# EAGLE design RF_module (EAGLE 7.2.0)
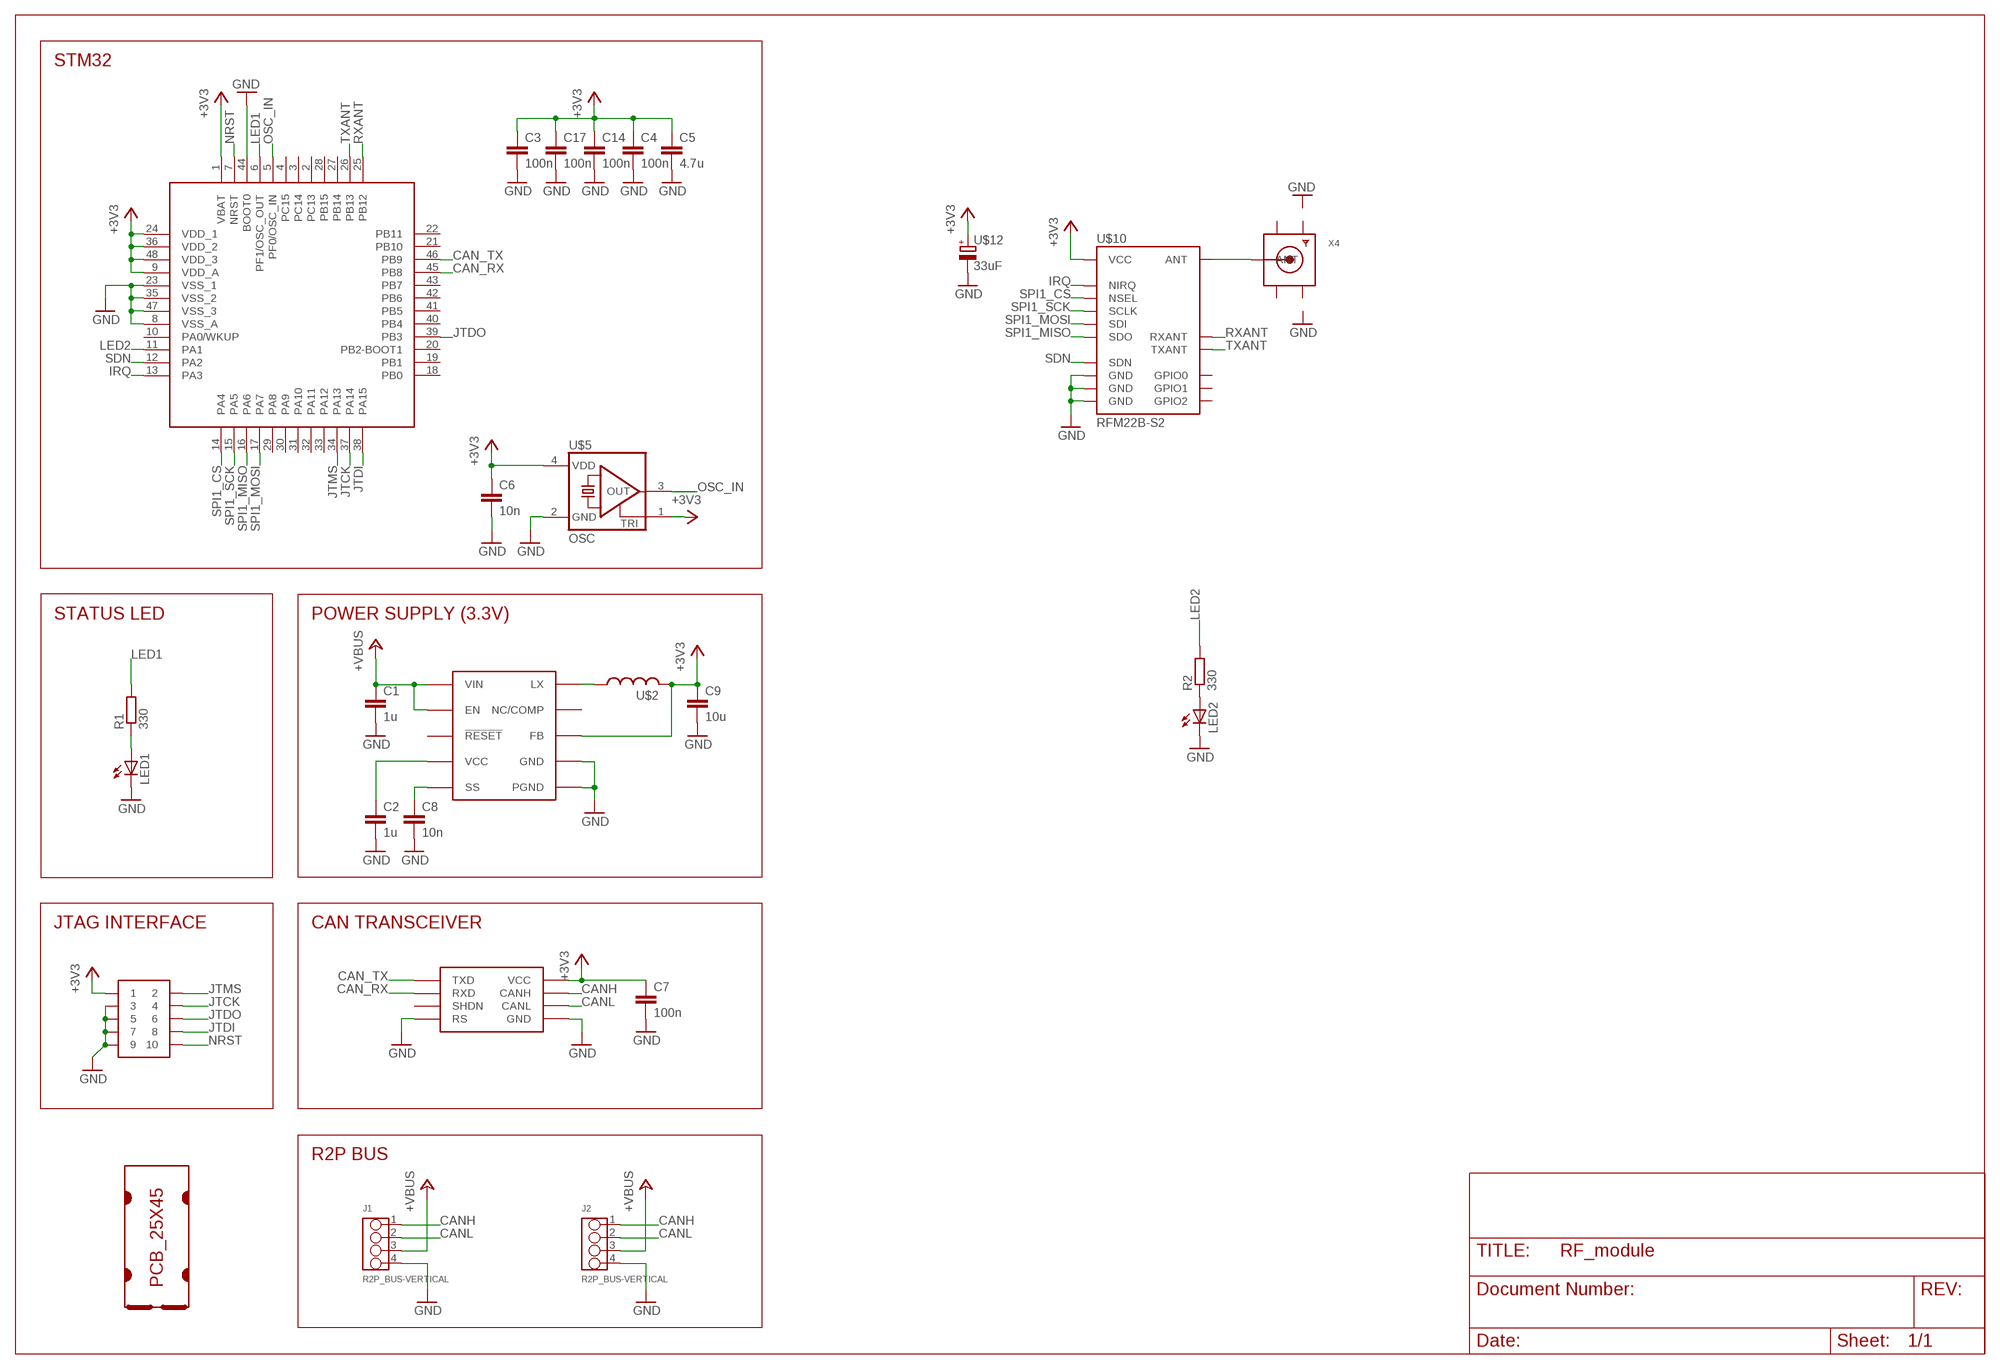
[diagram p0: schematic, sheet 1]

## Parts
C1  1u  C1206  [C1206]
C2  1u  C0603  [C0603]
C3  100n  C0603  [C0603]
C4  100n  C0603  [C0603]
C5  4.7u  C0805  [C0805]
C6  10n  C0603  [C0603]
C7  100n  C0603  [C0603]
C8  10n  C0603  [C0603]
C9  10u  C0805  [C0805]
C14  100n  C0603  [C0603]
C17  100n  C0603  [C0603]
J1  R2P_BUS-VERTICAL  [OPL-EAGLE-LIBRARY_4P-2.0]
J2  R2P_BUS-VERTICAL  [OPL-EAGLE-LIBRARY_4P-2.0]
LED1  LED0805  [CHIPLED_0805]
LED2  LED0805  [CHIPLED_0805]
R1  330  R0603  [R0603]
R2  330  R0603  [R0603]
SOT1  MAX3051EKA  [SOT23-8L]
U$1  PCB_25X45  [25X45]
U$2  LPS4018  [COILCRAFT_LPS4018]
U$3  MAX17501  [TDFN-10]
U$4  JTAG-TH  [SAMTEC_FTSH-105-TH]
U$5  OSC  [XTAL_2.5X2]
U$6  STM32F303CTX  [LQFP48]
U$10  RFM22B-S2  [RFM22B-S2]
U$12  33uF  CPOL  [CPOL_B]
X4  SMACONNECTOR_EDGE_UFL  [SMA_EDGELAUNCH_UFL]

## Nets
+3V3: C3.1 C4.1 C5.1 C6.1 C7.1 C9.1 C14.1 C17.1 SOT1.3(VCC) U$2.P$2 U$3.P$5(FB) U$4.1 U$5.1(TRI) U$5.4(VDD) U$6.1(VBAT) U$6.9(VDD_A) U$6.24(VDD_1) U$6.36(VDD_2) U$6.48(VDD_3) U$10.P$5(VCC) U$12.+
+VBUS: C1.1 J1.3 J2.3 U$3.P$2(VIN) U$3.P$3(EN)
CAN_RX: SOT1.4(RXD) U$6.45(PB8)
CAN_TX: SOT1.1(TXD) U$6.46(PB9)
CANH: J1.1 J2.1 SOT1.7(CANH)
CANL: J1.2 J2.2 SOT1.6(CANL)
GND: C1.2 C2.2 C3.2 C4.2 C5.2 C6.2 C7.2 C8.2 C9.2 C14.2 C17.2 J1.4 J2.4 LED1.C LED2.C SOT1.2(GND) SOT1.8(RS) U$3.P$1(PGND) U$3.P$9(GND) U$3.P$11(PGND) U$4.3 U$4.5 U$4.7 U$4.9 U$5.2(GND) U$6.8(VSS_A) U$6.23(VSS_1) U$6.35(VSS_2) U$6.44(BOOT0) U$6.47(VSS_3) U$10.P$2(GND) U$10.P$9(GND) U$10.P$16(GND) U$12.-
IRQ: U$6.13(PA3) U$10.P$14(NIRQ)
JTCK: U$4.4 U$6.37(PA14)
JTDI: U$4.8 U$6.38(PA15)
JTDO: U$4.6 U$6.39(PB3)
JTMS: U$4.2 U$6.34(PA13)
LED1: R1.2 U$6.6(PF1/OSC_OUT)
LED2: R2.2 U$6.11(PA1)
N$1: U$2.P$1 U$3.P$10(LX)
N$3: LED2.A R2.1
N$4: LED1.A R1.1
N$6: U$10.P$1(ANT) X4.P(ANT)
N$7: C2.1 U$3.P$4(VCC)
N$8: C8.1 U$3.P$6(SS)
NRST: U$4.10 U$6.7(NRST)
OSC_IN: U$5.3(OUT) U$6.5(PF0/OSC_IN)
RXANT: U$6.25(PB12) U$10.P$3(RXANT)
SDN: U$6.12(PA2) U$10.P$15(SDN)
SPI1_CS: U$6.14(PA4) U$10.P$13(NSEL)
SPI1_MISO: U$6.16(PA6) U$10.P$10(SDO)
SPI1_MOSI: U$6.17(PA7) U$10.P$11(SDI)
SPI1_SCK: U$6.15(PA5) U$10.P$12(SCLK)
TXANT: U$6.26(PB13) U$10.P$4(TXANT)
Unconnected: SOT1.5(SHDN) U$3.P$7(NC/COMP) U$3.P$8(!RESET) U$6.2(PC13) U$6.3(PC14) U$6.4(PC15) U$6.10(PA0/WKUP) U$6.18(PB0) U$6.19(PB1) U$6.20(PB2-BOOT1) U$6.21(PB10) U$6.22(PB11) U$6.27(PB14) U$6.28(PB15) U$6.29(PA8) U$6.30(PA9) U$6.31(PA10) U$6.32(PA11) U$6.33(PA12) U$6.40(PB4) U$6.41(PB5) U$6.42(PB6) U$6.43(PB7) U$10.P$6(GPIO0) U$10.P$7(GPIO1) U$10.P$8(GPIO2)

## Notes on the sheet
- STM32
- STATUS LED | POWER SUPPLY (3.3V)
- JTAG INTERFACE | CAN TRANSCEIVER
- R2P BUS

## Power pins joined to a net without a drawn wire
GND1: X4.GND@1(GND1)
GND2: X4.GND@2(GND2)
GND3: X4.GND@3(GND3)
GND4: X4.GND@4(GND4)

## Library data of the parts
C1-C9 C14 C17 = r2p_rcl:C
J1 J2 = r2p_connector:R2P_BUS
LED1 LED2 = r2p_led:LED
R1 R2 = r2p_rcl:R
SOT1 = r2p_ic:MAX3051
U$1 = r2p_pcb:PCB_25X45
U$2 = r2p_rcl:LPS4018
U$3 = r2p_ic:MAX17501
U$4 = r2p_connector:JTAG
U$5 = r2p_ic:OSC
U$6 = r2p_ic:STM32F303C
U$10 = r2p_rf:RFM22B-S2
U$12 = r2p_rcl:CPOL
X4 = adafruit:SMACONNECTOR: SMA Connector 90° DIP SMA Connector, 50 Ohm (4UConnector: 07259)

## Board
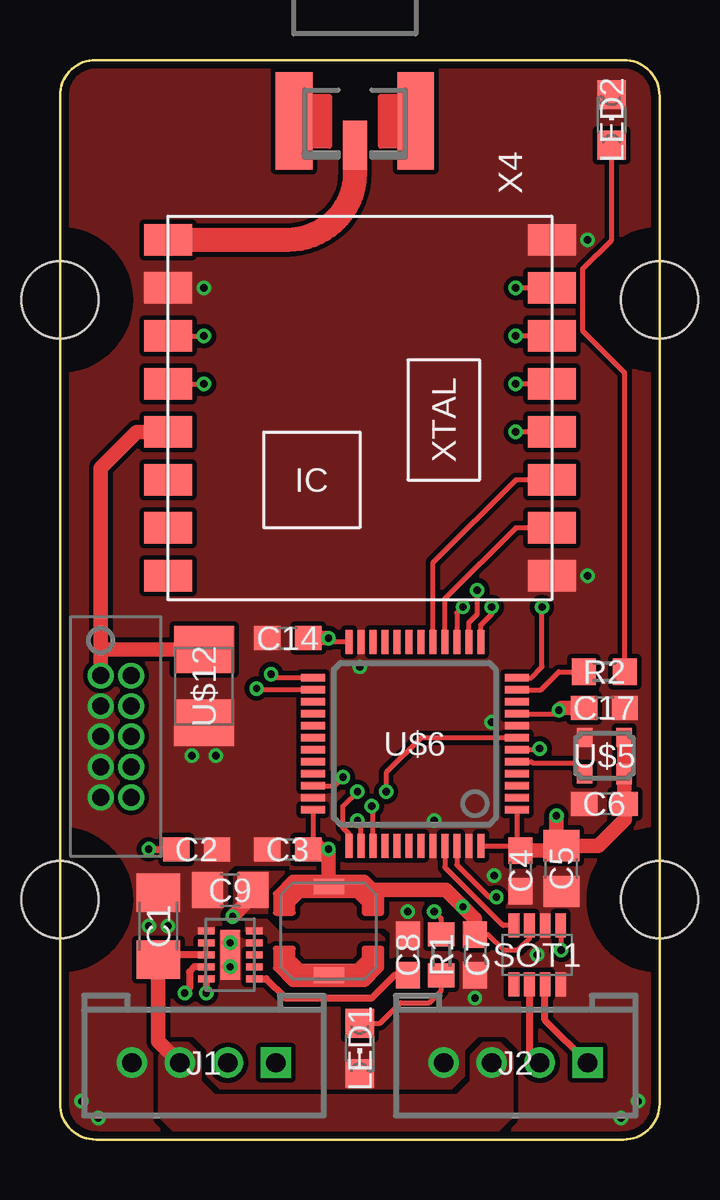
[diagram p1: board, top side]
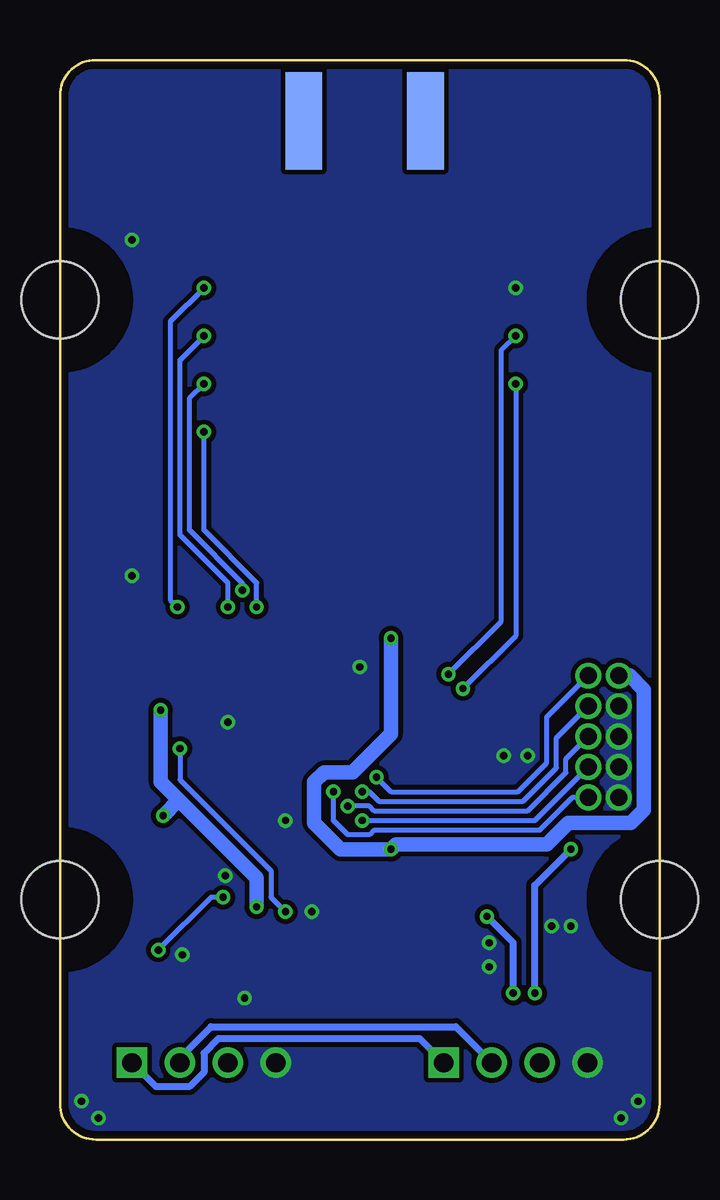
[diagram p2: board, bottom side, seen from below]

Size 25 x 45 mm. Coordinates in mm from the lower left corner, seen from the top.
Copper layers (1*16): Top 0.035mm / dielectric 1.5mm / Bottom 0.035mm
Design rules "2layer_0.2mm": minimum track width 0.2mm, minimum drill 0.3mm, track to track 0.2mm, track to pad 0.2mm, pad to pad 0.2mm, via to via 0.2mm, smd to smd 0mil, copper to edge 0.3mm, drill to drill 0.3mm, minimum pad ring 0.15mm, minimum via ring 0.15mm, stop-mask expansion 0.05mm, vias tented up to drill 2.5mm, thermal gap 0.25mm
tRestrict: 2 lines

### Footprints (pad centres in the part's own frame; a part is rotated, then mirrored left to right if it is on the bottom)
C1206 = smd 1.6 x 1.8: 1 -1.4,0; 2 1.4,0
C0603 = smd 1.1 x 1: 1 -0.85,0; 2 0.85,0
C0805 = smd 1.3 x 1.5: 1 -0.95,0; 2 0.95,0
OPL-EAGLE-LIBRARY_4P-2.0 = drill 0.8 pad 1.27 square: 1 -3,0 | drill 0.8 pad 1.27: 2 -1,0; 3 1,0; 4 3,0
CHIPLED_0805 = smd 1.2 x 1.2: A 0,-1.05; C 0,1.05
R0603 = smd 1 x 1.1: 1 -0.85,0; 2 0.85,0
SOT23-8L = smd 0.45 x 1: 1 -0.975,-1.225; 2 -0.325,-1.225; 3 0.325,-1.225; 4 0.975,-1.225; 5 0.975,1.225; 6 0.325,1.225; 7 -0.325,1.225; 8 -0.975,1.225
25X45 = hole 3.2: 0,10; 25,10; 0,35; 25,35
COILCRAFT_LPS4018 = smd 0.635 x 1.27: P$1 -1.85,0; P$2 1.85,0
TDFN-10 = smd 0.7 x 0.3: P$1 -1,1; P$2 -1,0.5; P$3 -1,0; P$4 -1,-0.5; P$5 -1,-1; P$6 1,-1; P$7 1,-0.5; P$8 1,0; P$9 1,0.5; P$10 1,1 | smd 0.8 x 2.08: P$11 0,0
SAMTEC_FTSH-105-TH = drill 0.711 pad 1.016: 1 -2.54,0; 2 -2.54,1.27; 3 -1.27,0; 4 -1.27,1.27; 5 0,0; 6 0,1.27; 7 1.27,0; 8 1.27,1.27; 9 2.54,0; 10 2.54,1.27
XTAL_2.5X2 = smd 0.65 x 0.8: 1 -0.825,-0.762; 2 0.825,-0.762; 3 0.825,0.762 | smd 0.65 x 0.85: 4 -0.825,0.762
LQFP48 = smd 1 x 0.3: 1 -4.25,2.75; 2 -4.25,2.25; 3 -4.25,1.75; 4 -4.25,1.25; 5 -4.25,0.75; 6 -4.25,0.25; 7 -4.25,-0.25; 8 -4.25,-0.75; 9 -4.25,-1.25; 10 -4.25,-1.75; 11 -4.25,-2.25; 12 -4.25,-2.75; 25 4.25,-2.75; 26 4.25,-2.25; 27 4.25,-1.75; 28 4.25,-1.25; 29 4.25,-0.75; 30 4.25,-0.25; 31 4.25,0.25; 32 4.25,0.75; 33 4.25,1.25; 34 4.25,1.75; 35 4.25,2.25; 36 4.25,2.75 | smd 0.3 x 1: 13 -2.75,-4.25; 14 -2.25,-4.25; 15 -1.75,-4.25; 16 -1.25,-4.25; 17 -0.75,-4.25; 18 -0.25,-4.25; 19 0.25,-4.25; 20 0.75,-4.25; 21 1.25,-4.25; 22 1.75,-4.25; 23 2.25,-4.25; 24 2.75,-4.25; 37 2.75,4.25; 38 2.25,4.25; 39 1.75,4.25; 40 1.25,4.25; 41 0.75,4.25; 42 0.25,4.25; 43 -0.25,4.25; 44 -0.75,4.25; 45 -1.25,4.25; 46 -1.75,4.25; 47 -2.25,4.25; 48 -2.75,4.25
RFM22B-S2 = smd 2 x 1.3: P$1 -8,7; P$2 -8,5; P$3 -8,3; P$4 -8,1; P$5 -8,-1; P$6 -8,-3; P$7 -8,-5; P$8 -8,-7; P$9 8,-7; P$10 8,-5; P$11 8,-3; P$12 8,-1; P$13 8,1; P$14 8,3; P$15 8,5; P$16 8,7
CPOL_B = smd 1.95 x 2.5: + 1.525,0; - -1.525,0
SMA_EDGELAUNCH_UFL = smd 4.064 x 1.524: GND@1 2.032,-2.54; GND@2 2.032,2.54 | smd 4.064 x 1.524 bottom: GND@3 2.032,2.54; GND@4 2.032,-2.54 | smd 2.032 x 1.016: P 3.048,0

### Placement (x,y rotation side)
C1  4.1,8.9 90 top
C2  5.7,12.1 0 top
C3  9.5,12.1 180 top
C4  19.2,11.2 270 top
C5  20.9,11.3 270 top
C6  22.7,14 180 top
C7  17.3,7.7 270 top
C8  14.5,7.7 90 top
C9  7.1,10.4 180 top
C14  9.5,20.9 180 top
C17  22.7,18 0 top
J1  6,3.2 180 top
J2  19,3.2 180 top
LED1  12.5,3.8 180 top
LED2  23,42.5 0 top
R1  15.9,7.7 90 top
R2  22.7,19.5 180 top
SOT1  19.9,7.7 180 top
U$1  0,0 0 top
U$2  11.2,8.7 90 top
U$3  7.1,7.7 0 top
U$4  1.7,16.8 270 top
U$5  22.7,16 180 top
U$6  14.8,16.5 180 top
U$10  12.5,30.5 0 top
U$12  6,18.9 90 top
X4  12.3,44.5 270 top

### Tracks (layer width: path | path; a pad name or v marks a point on that pad's centre or on a via)
+3V3  (via drill 0.3)
  Top 0.2: C7.1 17.85,8.55 18.5,7.9 19.1,7.9 19.57,8.38 SOT1.3 | U$6.36 10.55,12.3 C3.1 | U$6.48 19,12.25 19.05,12.2 | U$6.1 19.05,12.2 | 19.05,12.2 C4.1 | U$6.24 11.35,20.75 v11.2,20.9 | U$6.9 20.65,17.75 v20.8,17.9 | C17.1 22,18
  Top 0.3: U$3.P$5 v6.1,6.1
  Top 0.6: 10.55,12.3 10.7,12.3 | C7.1 17.3,9.2 v16.8,9.7 16.1,10.4 12.6,10.4 | C3.1 v11.2,12.1 U$2.P$2 | C14.1 v11.2,20.9 | U$5.1 U$5.4 23.52,14.03 C6.1 23.55,13.35 22.45,12.25 C5.1 | C4.1 20.7,12.05 C5.1 | 19.05,12.2 19.05,12.05 19,12 | C17.1 20.9,18 v20.8,17.9 | C5.1 20.7,12.45 v20.7,13.5 | v7.2,9.3 8.05,10.15 C9.1 | U$10.P$5 3.2,29.5 1.7,28 1.7,20.4 | 1.7,20.4 U$4.1 | U$12.+ 1.73,20.43 1.7,20.4
  Bottom 0.3: v6.1,6.1 6.1,8.2 v7.2,9.3
  Bottom 0.6: U$4.1 1.24,19.34 0.65,18.75 0.65,13.75 1.2,13.2 3.8,13.2 4.7,12.3 11,12.3 v11.2,12.1 13.3,12.1 14.4,13.2 14.4,14.9 14,15.3 12.8,15.3 11.2,16.9 v11.2,20.9 | 20.05,14.15 16.8,10.9 v16.8,9.7 | v20.7,13.5 20.05,14.15 | 20.05,14.15 20.8,14.9 v20.8,17.9
  pour Top (rank 5, no thermals): 13.3,8.9 13.5,9.1 13.5,10.3 12.8,11 9.5,11 9.4,11.1 7.5,11.1 7.3,10.9 7.3,9.8 8.3,8.9
+VBUS
  Top 0.2: U$3.P$3 U$3.P$2
  Top 0.3: U$3.P$3 4.3,7.7 C1.1
  Top 0.6: C1.1 4.1,4.1 J1.3
  pour Top (no thermals): 4.7,4 5.3,4 5.8,3.5 5.8,2.4 6.4,1.8 16.6,1.8 17.2,2.4 17.2,3.5 17.7,4 18.3,4 18.8,3.5 18.8,1 17.8,0 5.2,0 4.2,1 4.2,3.5
CAN_RX
  Top 0.2: U$6.45 16.05,11.35 18.4,9 18.48,8.93 SOT1.4
CAN_TX  (via drill 0.3)
  Top 0.2: U$6.46 16.55,11.45 17.9,10.1 v18.2,10.1 | SOT1.1 20.88,7.92 v20.9,7.9
  Bottom 0.2: v18.2,10.1 18.7,10.1 v20.9,7.9
CANH
  Top 0.3: J2.1 20.23,4.97 SOT1.7
  Bottom 0.3: J1.1 10,4.2 18.4,4.2 19,3.6 19,2.8 19.6,2.2 21,2.2 J2.1
CANL
  Top 0.3: 19.57,3.62 J2.2 19.57,3.62 | SOT1.6 19.57,3.62
  Bottom 0.3: J1.2 8.5,4.7 18.7,4.7 20,3.4 J2.2
GND  (via drill 0.3)
  other vias: 7.1,8.2 7.1,7.2 4.5,8.9 3.7,8.9 17.3,5.9 19.9,7.7 24.1,1.6 23.4,0.9 1.6,0.9 0.9,1.6 18,17.4 18.1,11 14.5,9.5 12.5,19.7 15.6,13.3 22,23.5 22,37.5 6,35.5 6.5,16 5.5,16
  pour Bottom (rank 6, no thermals): 0,0 25,0 25,45 0,45
  pour Top (rank 6, no thermals): 0,0 25,0 25,45 0,45
IRQ  (via drill 0.3)
  Top 0.2: U$10.P$14 v19,33.5 | U$6.13 17.55,21.45 18,21.9 v18,22.2
  Bottom 0.2: v19,33.5 20,32.5 20,25.2 18,23.2 v18,22.2
JTCK  (via drill 0.3)
  Top 0.2: U$6.37 12.05,12.75 11.8,13 11.8,13.9 v12.4,14.5
  Bottom 0.2: v12.4,14.5 12.1,14.5 11.7,14.1 5.7,14.1 4.3,15.5 4.3,16.74 U$4.4
JTDI  (via drill 0.3)
  Top 0.2: U$6.38 12.55,13.15 v12.4,13.3
  Bottom 0.2: v12.4,13.3 5.2,13.3 U$4.8
JTDO  (via drill 0.3)
  Top 0.2: U$6.39 13.05,13.85 v13,13.9
  Bottom 0.2: v13,13.9 12.1,13.9 11.9,13.7 5.5,13.7 3.9,15.3 3.9,15.87 U$4.6
JTMS  (via drill 0.3)
  Top 0.2: U$6.34 11.45,14.75 v11.8,15.1
  Bottom 0.2: v11.8,15.1 11.2,14.5 5.9,14.5 4.7,15.7 4.7,17.61 U$4.2
LED1  (via drill 0.3)
  Top 0.2: v20,16.3 19.95,16.25 U$6.6 | R1.2 15.9,9.2 v15.6,9.5
  Bottom 0.2: v20,16.3 20,15 16.2,11.2 16.2,10.1 v15.6,9.5
LED2
  Top 0.2: U$6.11 20.05,18.75 20.8,19.5 R2.2
N$1
  pour Top (no thermals): 7.8,8.7 8.2,8.7 8.5,8.2 8.5,7.5 9.6,6.4 12.8,6.4 13.5,7.1 13.5,8.3 13.3,8.5 9.2,8.5 8.6,9.1 7.8,9.1
N$3
  Top 0.2: R2.1 23.55,31.95 21.8,33.7 21.8,36.3 23,37.5 LED2.A
N$4
  Top 0.2: R1.1 15.9,6.2 15.4,5.7 14.2,5.7 13.35,4.85 LED1.A
N$6
  Top 1: X4.P 12.3,40.3 arc-90 9.5,37.5 U$10.P$1
N$7  (via drill 0.3)
  Top 0.3: U$3.P$4 5.6,7.2 5.4,7 5.4,6.3 v5.2,6.1 | v3.7,12.1 C2.1
  Bottom 0.3: v5.2,6.1 5.2,10.6 v3.7,12.1
N$8
  Top 0.3: U$3.P$6 8.6,6.7 9.4,5.9 13,5.9 13.95,6.85 C8.1
NRST  (via drill 0.3)
  Top 0.2: U$6.7 15.05,16.75 13.6,15.3 v13.6,14.5
  Bottom 0.2: v13.6,14.5 13.6,13.3 13,12.7 12.1,12.7 11.9,12.9 5,12.9 3.64,14.26 U$4.10
OSC_IN
  Top 0.2: U$6.5 19.65,15.75 19.7,15.7 21.41,15.7 U$5.3
RXANT  (via drill 0.3)
  Top 0.2: U$10.P$3 v6,33.5 | U$6.25 8.95,19.25 v8.8,19.4
  Bottom 0.2: v8.8,19.4 6.6,21.6 6.6,32.9 v6,33.5
SDN  (via drill 0.3)
  Top 0.2: U$10.P$15 v19,35.5 | U$6.12 19.65,19.25 20.1,19.7 v20.1,22.2
  Bottom 0.2: v19,35.5 20.4,34.1 20.4,22.5 v20.1,22.2
SPI1_CS  (via drill 0.3)
  Top 0.2: U$10.P$13 v19,31.5 | U$6.14 17.05,21.55 17.4,21.9 v17.4,22.9
  Bottom 0.2: v19,31.5 19.6,30.9 19.6,25.4 17.4,23.2 v17.4,22.9
SPI1_MISO
  Top 0.2: U$10.P$10 19,25.5 16.05,22.55 U$6.16
SPI1_MOSI
  Top 0.2: U$10.P$11 19,27.5 15.55,24.05 U$6.17
SPI1_SCK  (via drill 0.3)
  Top 0.2: U$10.P$12 v19,29.5 | v16.8,22.2 16.55,21.95 U$6.15
  Bottom 0.2: v16.8,22.2 16.8,23.2 19,25.4 v19,29.5
TXANT  (via drill 0.3)
  Top 0.2: U$10.P$4 v6,31.5 | U$6.26 8.25,18.75 v8.2,18.8
  Bottom 0.2: v6,31.5 6,21 v8.2,18.8

### Text on the board
Document: LINK
200bmp: RF module / v1.0 (2015/02)